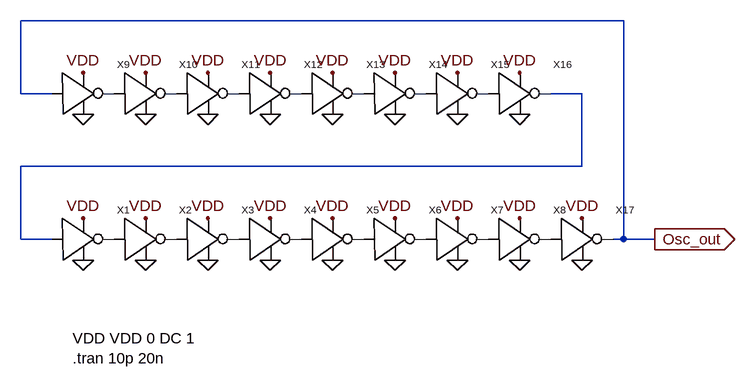
[diagram p0: schematic Draft2.asc]
Draft2.asc, the LTspice schematic file:
Version 4
SHEET 1 1132 680
WIRE 928 -128 0 -128
WIRE 0 -16 0 -128
WIRE 48 -16 0 -16
WIRE 864 -16 816 -16
WIRE 864 96 864 -16
WIRE 864 96 0 96
WIRE 0 208 0 96
WIRE 48 208 0 208
WIRE 928 208 928 -128
WIRE 928 208 912 208
WIRE 976 208 928 208
FLAG 96 240 0
FLAG 96 176 VDD
FLAG 192 240 0
FLAG 192 176 VDD
FLAG 288 240 0
FLAG 288 176 VDD
FLAG 384 240 0
FLAG 384 176 VDD
FLAG 480 240 0
FLAG 480 176 VDD
FLAG 576 240 0
FLAG 576 176 VDD
FLAG 672 240 0
FLAG 672 176 VDD
FLAG 768 240 0
FLAG 768 176 VDD
FLAG 96 16 0
FLAG 96 -48 VDD
FLAG 192 16 0
FLAG 192 -48 VDD
FLAG 288 16 0
FLAG 288 -48 VDD
FLAG 384 16 0
FLAG 384 -48 VDD
FLAG 480 16 0
FLAG 480 -48 VDD
FLAG 576 16 0
FLAG 576 -48 VDD
FLAG 672 16 0
FLAG 672 -48 VDD
FLAG 768 16 0
FLAG 768 -48 VDD
FLAG 864 240 0
FLAG 864 176 VDD
FLAG 976 208 Osc_out
IOPIN 976 208 Out
SYMBOL inv 64 208 R0
SYMATTR InstName X1
SYMBOL inv 160 208 R0
SYMATTR InstName X2
SYMBOL inv 256 208 R0
SYMATTR InstName X3
SYMBOL inv 352 208 R0
SYMATTR InstName X4
SYMBOL inv 448 208 R0
SYMATTR InstName X5
SYMBOL inv 544 208 R0
SYMATTR InstName X6
SYMBOL inv 640 208 R0
SYMATTR InstName X7
SYMBOL inv 736 208 R0
SYMATTR InstName X8
SYMBOL inv 64 -16 R0
SYMATTR InstName X9
SYMBOL inv 160 -16 R0
SYMATTR InstName X10
SYMBOL inv 256 -16 R0
SYMATTR InstName X11
SYMBOL inv 352 -16 R0
SYMATTR InstName X12
SYMBOL inv 448 -16 R0
SYMATTR InstName X13
SYMBOL inv 544 -16 R0
SYMATTR InstName X14
SYMBOL inv 640 -16 R0
SYMATTR InstName X15
SYMBOL inv 736 -16 R0
SYMATTR InstName X16
SYMBOL inv 832 208 R0
SYMATTR InstName X17
TEXT 80 360 Left 2 !VDD VDD 0 DC 1\n.tran 10p 20n

The netlist it stands for:
* Draft2.asc
XX1 N001 VDD 0 P001 inv  ; pins In VDD DGND Out
XX2 P001 VDD 0 P002 inv  ; pins In VDD DGND Out
XX3 P002 VDD 0 P003 inv  ; pins In VDD DGND Out
XX4 P003 VDD 0 P004 inv  ; pins In VDD DGND Out
XX5 P004 VDD 0 P005 inv  ; pins In VDD DGND Out
XX6 P005 VDD 0 P006 inv  ; pins In VDD DGND Out
XX7 P006 VDD 0 P007 inv  ; pins In VDD DGND Out
XX8 P007 VDD 0 P008 inv  ; pins In VDD DGND Out
XX9 Osc_out VDD 0 P009 inv  ; pins In VDD DGND Out
XX10 P009 VDD 0 P010 inv  ; pins In VDD DGND Out
XX11 P010 VDD 0 P011 inv  ; pins In VDD DGND Out
XX12 P011 VDD 0 P012 inv  ; pins In VDD DGND Out
XX13 P012 VDD 0 P013 inv  ; pins In VDD DGND Out
XX14 P013 VDD 0 P014 inv  ; pins In VDD DGND Out
XX15 P014 VDD 0 P015 inv  ; pins In VDD DGND Out
XX16 P015 VDD 0 N001 inv  ; pins In VDD DGND Out
XX17 P008 VDD 0 Osc_out inv  ; pins In VDD DGND Out
VDD VDD 0 DC 1
.tran 10p 20n
.backanno
.end